# EAGLE design Sp_OLED_BUTTOMS (EAGLE 9.6.2)
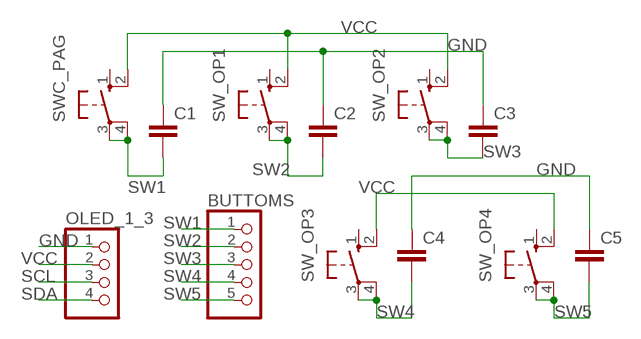
[diagram p0: schematic, sheet 1]

## Parts
BUTTOMS  PINHD-1X5  [1X05]
C1  C2,5-3  [C2.5-3]
C2  C2,5-3  [C2.5-3]
C3  C2,5-3  [C2.5-3]
C4  C2,5-3  [C2.5-3]
C5  C2,5-3  [C2.5-3]
OLED_1_3  PINHD-1X4  [1X04]
SW_OP1  10-XX  [B3F-10XX]
SW_OP2  10-XX  [B3F-10XX]
SW_OP3  10-XX  [B3F-10XX]
SW_OP4  10-XX  [B3F-10XX]
SWC_PAG  10-XX  [B3F-10XX]

## Nets
GND: C1.1 C2.1 C3.1 C4.1 C5.1 OLED_1_3.1
SCL: OLED_1_3.3
SDA: OLED_1_3.4
SW1: BUTTOMS.1 C1.2 SWC_PAG.3(P) SWC_PAG.4(P1)
SW2: BUTTOMS.2 C2.2 SW_OP1.3(P) SW_OP1.4(P1)
SW3: BUTTOMS.3 C3.2 SW_OP2.3(P) SW_OP2.4(P1)
SW4: BUTTOMS.4 C4.2 SW_OP3.3(P) SW_OP3.4(P1)
SW5: BUTTOMS.5 C5.2 SW_OP4.3(P) SW_OP4.4(P1)
VCC: OLED_1_3.2 SW_OP1.2(S1) SW_OP2.2(S1) SW_OP3.2(S1) SW_OP4.2(S1) SWC_PAG.2(S1)
Unconnected: SW_OP1.1(S) SW_OP2.1(S) SW_OP3.1(S) SW_OP4.1(S) SWC_PAG.1(S)

## Library data of the parts
BUTTOMS = pinhead:PINHD-1X5: PIN HEADER
C1-C5 = capacitor-wima:C: CAPACITOR naming: grid - package width
OLED_1_3 = pinhead:PINHD-1X4: PIN HEADER
SW_OP1-SW_OP4 SWC_PAG = switch-omron:10-XX: OMRON SWITCH; MPN: B3F-1000; OC_FARNELL: 176432; OC_NEWARK: 36M3542

## Board
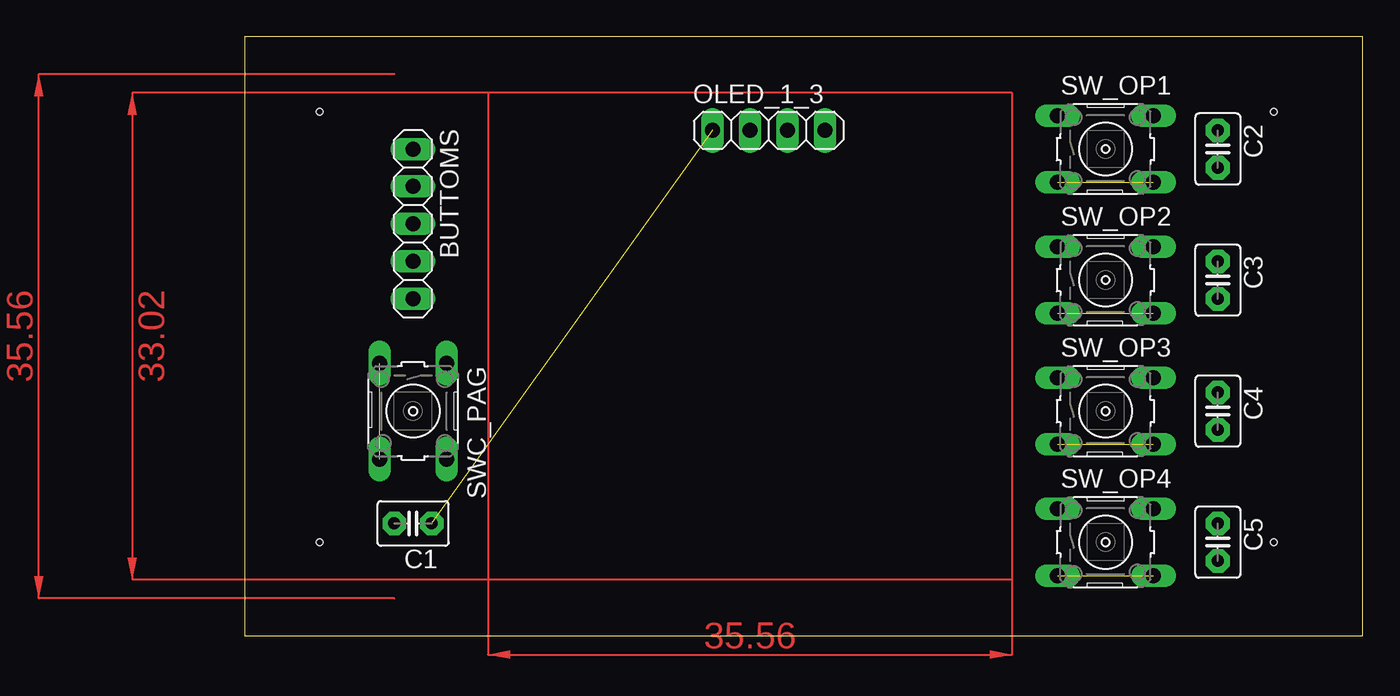
[diagram p1: board, top side]
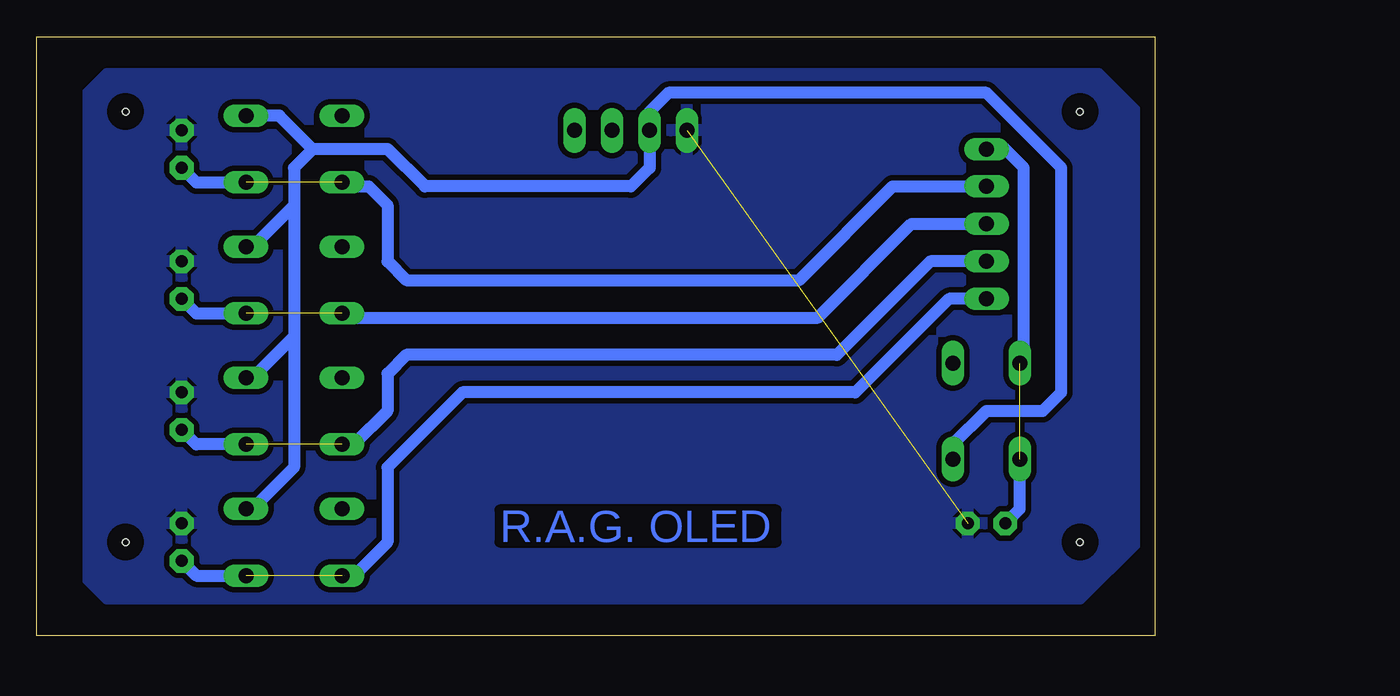
[diagram p2: board, bottom side, seen from below]

Size 75.87 x 40.63 mm. Coordinates in mm from the lower left corner, seen from the top.
Outline: 0,0 75.87,0 75.87,40.63 0,40.63 0,0
Copper layers (1*16): Top 0.035mm / dielectric 1.5mm / Bottom 0.035mm
Design rules "default *": minimum track width 6mil, minimum drill 0.35mm, track to track 15mil, track to pad 15mil, pad to pad 15mil, via to via 15mil, smd to smd 6mil, copper to edge 40mil, drill to drill 6mil, minimum pad ring 10mil, minimum via ring 8mil, stop-mask expansion 4mil, vias tented up to drill 0mil, thermal gap 10mil
Holes 0.45 mm at 5.08,6.35 69.85,35.56 69.85,6.35 5.08,35.56

### Footprints (pad centres in the part's own frame; a part is rotated, then mirrored left to right if it is on the bottom)
1X05 = drill 1.016 long: 1 -5.08,0; 2 -2.54,0; 3 0,0; 4 2.54,0; 5 5.08,0
C2.5-3 = drill 0.813 pad 1.6 octagon: 1 -1.27,0; 2 1.27,0
1X04 = drill 1.016 long: 1 -3.81,0; 2 -1.27,0; 3 1.27,0; 4 3.81,0
B3F-10XX = drill 1.016 long: 1 -3.251,2.261; 2 3.251,2.261; 3 -3.251,-2.261; 4 3.251,-2.261

### Placement (x,y rotation side)
BUTTOMS  11.43,27.94 270 top
C1  11.43,7.62 180 top
C2  66.04,33.02 270 top
C3  66.04,24.13 270 top
C4  66.04,15.24 270 top
C5  66.04,6.35 270 top
OLED_1_3  35.56,34.29 0 top
SW_OP1  58.42,33.02 0 top
SW_OP2  58.42,24.13 0 top
SW_OP3  58.42,15.24 0 top
SW_OP4  58.42,6.35 0 top
SWC_PAG  11.43,15.24 270 top

### Tracks (layer width: path | path; a pad name or v marks a point on that pad's centre or on a via)
GND  (1 unrouted)
  pour Bottom: 1.27,6.35 1.27,35.56 3.81,38.1 71.12,38.1 72.39,36.83 72.39,3.81 71.12,2.54 5.08,2.54
SW1  (1 unrouted)
  Bottom 0.813: C1.2 9.17,8.61 SWC_PAG.4 | BUTTOMS.1 10.16,33.02 8.89,31.75 8.89,18.77 SWC_PAG.3
SW2  (1 unrouted)
  Bottom 0.813: SW_OP1.3 54.89,30.48 53.34,30.48 52.07,29.21 52.07,25.4 50.8,24.13 24.13,24.13 17.78,30.48 BUTTOMS.2 | C2.2 65.05,30.76 SW_OP1.4
SW3  (1 unrouted)
  Bottom 0.813: BUTTOMS.3 16.51,27.94 22.86,21.59 54.89,21.59 SW_OP2.3 | C3.2 65.05,21.87 SW_OP2.4
SW4  (1 unrouted)
  Bottom 0.813: BUTTOMS.4 15.24,25.4 21.59,19.05 50.8,19.05 52.07,17.78 52.07,15.24 54.33,12.98 SW_OP3.3 | SW_OP3.4 65.05,12.98 C4.2
SW5  (1 unrouted)
  Bottom 0.813: BUTTOMS.5 13.97,22.86 20.32,16.51 46.99,16.51 52.07,11.43 52.07,6.35 54.33,4.09 SW_OP4.3 | C5.2 65.05,4.09 SW_OP4.4
VCC
  Bottom 0.813: 57.15,33.02 52.07,33.02 49.53,30.48 35.56,30.48 34.29,31.75 OLED_1_3.2 34.29,35.56 33.02,36.83 11.43,36.83 6.35,31.75 6.35,16.51 7.62,15.24 11.43,15.24 13.69,12.98 SWC_PAG.2 | 57.15,33.02 58.42,31.75 58.42,29.21 | 58.42,29.21 58.42,20.32 | 58.42,20.32 58.42,11.43 61.24,8.61 SW_OP4.2 | 61.39,17.78 60.96,17.78 | 60.96,17.78 58.42,20.32 | 58.42,29.21 60.96,26.67 61.39,26.67 SW_OP2.2 | 57.15,33.02 59.41,35.28 SW_OP1.2 | SW_OP3.2 61.24,17.5 60.96,17.78
(copper drawn outside any net)
  shapes: Top area x3

### Text on the board
Bottom: R.A.G. OLED